# EasyEDA Pro project MPU6050模块.epro

# Schematic Schematic1
Board Name: Board1; Create Date: 2025-09-03; Page Name: P1; Project Name: MPU6050; Schematic Name: Schematic1; Update Date: 2025-09-03; Company: 嘉立创EDA; Page Size: A4; Version: V1.0
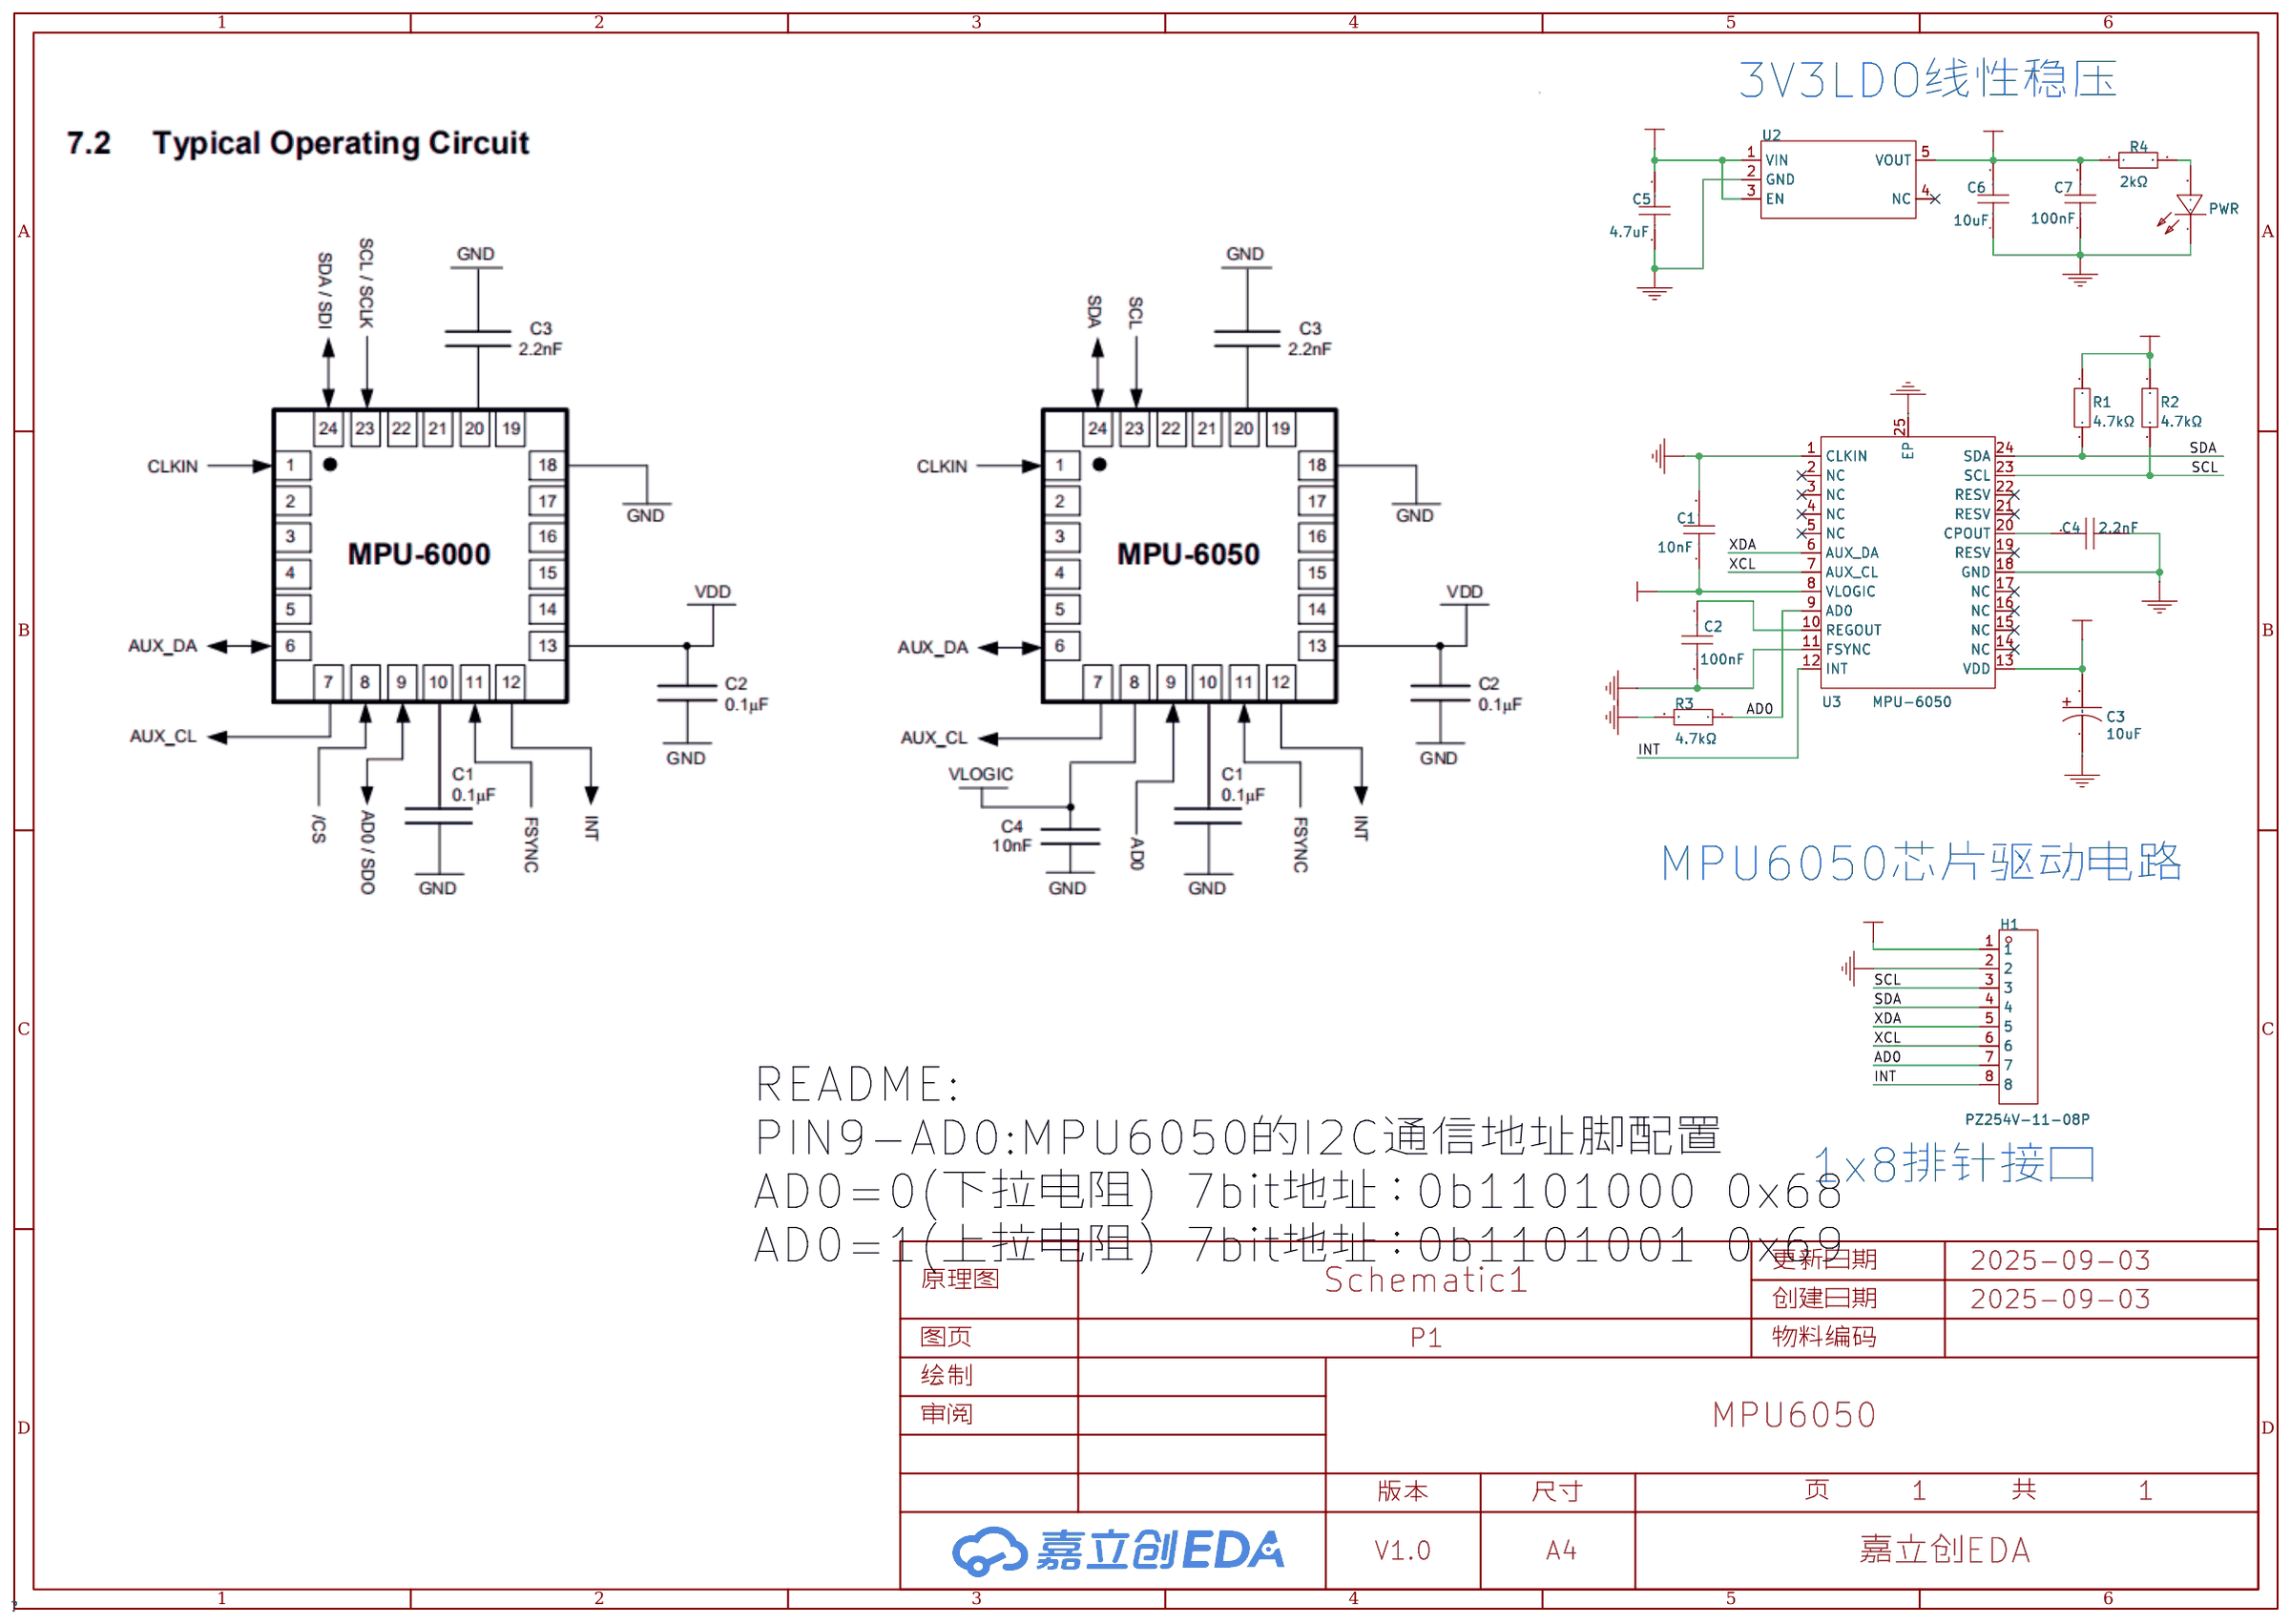
[diagram p0: schematic sheet]

## Parts
C1  10nF  [C0402]
C2  100nF  [C0402]
C3  10uF  [CAP-SMD_L3.2-W1.6]
C4  2.2nF  [C0402]
C5  4.7uF  [C0402]
C6  10uF  [C0402]
C7  100nF  [C0402]
H1  PZ254V-11-08P  [HDR-TH_8P-P2.54-V-M]
PWR  LTST-C193KRKT-5A  [LED0603-RD]
R1  4.7kΩ  [R0402]
R2  4.7kΩ  [R0402]
R3  4.7kΩ  [R0402]
R4  2kΩ  [R0402]
U2  HX9193-33GB  [SOT-23-5_L3.0-W1.7-P0.95-LS2.8-BR]
U3  MPU-6050  [QFN-24_L4.0-W4.0-P0.50-BL-EP2.7]

## Library data of the parts
C1 = CL05B103KB5NNNC: 容值:10nF;精度:±10%;额定电压:50V;温度系数:X7R;; LCSC Part Name: 10nF ±10% 50V; Supplier Part: C15195; Manufacturer: SAMSUNG(三星); Supplier Footprint: 0402; JLCPCB Part Class: Basic Part; Datasheet: https://item.szlcsc.com/datasheet/CL05B103KB5NNNC/15869.html; Supplier: LCSC; Tolerance: ±10%; Voltage Rating: 50V; Temperature Coefficient: X7R
C2 C7 = CL05B104KO5NNNC: 容值:100nF;精度:±10%;额定电压:16V;材质(温度系数):X7R;; LCSC Part Name: 100nF ±10% 16V; Supplier Part: C1525; Manufacturer: SAMSUNG(三星); Supplier Footprint: 0402; JLCPCB Part Class: Basic Part; Datasheet: https://atta.szlcsc.com/upload/public/pdf/source/20160218/1457707763339.pdf; Supplier: LCSC; Tolerance: ±10%; Voltage Rated: 16V; Temperature Coefficient: X7R
C3 = TPSA106K016R1000: 容值:10uF;精度:±10%;额定电压:16V;等效串联电阻:1Ω@100kHz;; LCSC Part Name: 10uF ±10% 16V; Supplier Part: C282116; Manufacturer: Kyocera AVX; Supplier Footprint: CASE-A-3216-18(mm); JLCPCB Part Class: Extended Part; Datasheet: https://atta.szlcsc.com/upload/public/pdf/source/20181129/C308928_3E6DA6FC57C95F0966ACBCD944046350.pdf; Supplier: LCSC; Tolerance: ±10%; Rated Voltage: 16V; Equivalent Series Resistance(ESR): 1Ω@100kHz; Operating Temperature: -55℃~+125℃
C4 = 0402B222K500NT: 容值:2.2nF;精度:±10%;额定电压:50V;材质(温度系数):X7R;; LCSC Part Name: 2.2nF ±10% 50V; Supplier Part: C1531; Manufacturer: FH(风华); Supplier Footprint: 0402; JLCPCB Part Class: Extended Part; Datasheet: https://atta.szlcsc.com/upload/public/pdf/source/20200305/C486355_26A10D38EF8C2A5C37091D0039909270.pdf; Supplier: LCSC; Tolerance: ±10%; Voltage Rated: 50V; Temperature Coefficient: X7R
C5 = CL05A475MP5NRNC: 容值:4.7uF;精度:±20%;额定电压:10V;材质(温度系数):X5R;; LCSC Part Name: 4.7uF ±20% 10V; Supplier Part: C23733; Manufacturer: SAMSUNG(三星); Supplier Footprint: 0402; JLCPCB Part Class: Basic Part; Datasheet: https://atta.szlcsc.com/upload/public/pdf/source/20160218/1457707763339.pdf; Supplier: LCSC; Tolerance: ±20%; Voltage Rated: 10V; Temperature Coefficient: X5R
C6 = CL05A106MQ5NUNC: 容值:10uF;精度:±20%;额定电压:6.3V;材质(温度系数):X5R;; LCSC Part Name: 10uF ±20% 6.3V; Supplier Part: C15525; Manufacturer: SAMSUNG(三星); Supplier Footprint: 0402; JLCPCB Part Class: Basic Part; Datasheet: https://atta.szlcsc.com/upload/public/pdf/source/20220823/2B02EE04F8F211D38A52DCB16EB6BEBA.pdf; Supplier: LCSC; Tolerance: ±20%; Voltage Rated: 6.3V; Temperature Coefficient: X5R
H1 = PZ254V-11-08P: 插针结构:1x8P;间距:2.54mm;行距:-;圆针/方针:方针;安装类型:直插;排数:单排;总PIN位数:8P;额定电流:-;额定电压:-;配合针长度:6mm;塑高:2.5mm;端接针长度:3mm;触头材质:黄铜;触头镀层:-;工作温度范围:-40℃~+105℃;颜色:黑色;; LCSC Part Name: 间距:2.54mm 1x8P 直插 方针; Supplier Part: C492407; Manufacturer: XFCN(兴飞); Supplier Footprint: 插件,P=2.54mm; JLCPCB Part Class: 扩展库; Datasheet: https://atta.szlcsc.com/upload/public/pdf/source/20200309/C492407_83A6FB26A2233368EDB9516968EC6149.pdf; Supplier: LCSC; Pin Structure: 1x8P; Pitch: 2.54mm; Circluar Pins/Square Pins: 方针; Mounting Type: 直插; Number of Rows: 单排; Number of Pins: 8P; Length of Mating Pin: 6mm; Insulation Height: 2.5mm; Length of End Connection Pin: 3mm; Contact Material: 黄铜; Operating Temperature Range: -40℃~+105℃; Color: 黑色
PWR = LTST-C193KRKT-5A: 发光颜色:红色;正向电压(VF):2V;功率:50mW;正向电流:5mA;主波长:631nm;二极管配置:-;透镜颜色:无色透明透镜;色温:-;发光强度:26.05mcd;发光角度:130°;载带方式:-;工作温度:-30℃~+85℃;; LCSC Part Name: 红灯; Supplier Part: C157741; Manufacturer: LITEON(光宝); Supplier Footprint: 0603; JLCPCB Part Class: 扩展库; Datasheet: https://atta.szlcsc.com/upload/public/pdf/source/20180224/C157741_15194362116061363471.PDF; Supplier: LCSC; Emitted Color: 红色; Forward Voltage (VF): 2V; Power Dissipation: 50mW; Forward Current: 5mA; Dominant Wavelength: 631nm; Peak Wavelength: 639nm; Lens Color: 无色透明透镜; Luminous Intensity: 26.05mcd; Viewing Angle: 130°; Operating Temperature: -30℃~+85℃
R1-R3 = 0402WGF4701TCE: 电阻类型:厚膜电阻;阻值:4.7kΩ;精度:±1%;功率:62.5mW;最大工作电压:50V;温度系数:±100ppm/℃;; LCSC Part Name: 4.7kΩ ±1% 62.5mW 厚膜电阻; Supplier Part: C25900; Manufacturer: UNI-ROYAL(厚声); Supplier Footprint: 0402; JLCPCB Part Class: Basic Part; Datasheet: https://atta.szlcsc.com/upload/public/pdf/source/20200306/C422600_1E6D84923E4A46A82E41ADD87F860B5C.pdf; Supplier: LCSC; Type: 厚膜电阻; Tolerance: ±1%; Power(Watts): 62.5mW; Overload Voltage (Max): 50V; Temperature Coefficient: ±100ppm/℃; Operating Temperature Range: -55℃~+155℃
R4 = 0402WGF2001TCE: 电阻类型:厚膜电阻;阻值:2kΩ;精度:±1%;功率:62.5mW;最大工作电压:50V;温度系数:±100ppm/℃;; LCSC Part Name: 2kΩ ±1% 62.5mW 厚膜电阻; Supplier Part: C4109; Manufacturer: UNI-ROYAL(厚声); Supplier Footprint: 0402; JLCPCB Part Class: Basic Part; Datasheet: https://atta.szlcsc.com/upload/public/pdf/source/20200306/C422600_1E6D84923E4A46A82E41ADD87F860B5C.pdf; Supplier: LCSC; Type: 厚膜电阻; Tolerance: ±1%; Power(Watts): 62.5mW; Overload Voltage (Max): 50V; Temperature Coefficient: ±100ppm/℃; Operating Temperature Range: -55℃~+155℃
U2 = HX9193-33GB: 输出类型:固定;最大输入电压:6V;输出电压:3.3V;最大输出电流:600mA;电源纹波抑制比(PSRR):65dB@(1kHz);输出极性:正极;; LCSC Part Name: 输入6V 输出3.3V 600mA; Supplier Part: C296123; Manufacturer: HX(恒佳兴); Supplier Footprint: SOT-23-5; JLCPCB Part Class: Extended Part; Datasheet: https://atta.szlcsc.com/upload/public/pdf/source/20181113/C296125_4A6BFA04F91094CE246063098530E6D9.pdf; Supplier: LCSC; Output Type: 固定; Maximum Input Voltage: 6V; Output Voltage: 3.3V; MAX Output Current: 600mA; Power Supply Rejection Ratio (PSRR): 65dB@(1kHz); Dropout Voltage: 480mV@(600mA); Output Polarity: 正极; Number of Outputs: 1
U3 = MPU-6050: 传感器类型:加速度计陀螺仪;; Supplier Part: C24112; Manufacturer: TDK InvenSense(应美盛); Supplier Footprint: QFN-24-EP(4x4); JLCPCB Part Class: 扩展库; Datasheet: https://atta.szlcsc.com/upload/public/pdf/source/20140425/1457707046159.pdf; Supplier: LCSC; Sensor Type: 加速度计陀螺仪; Operating Temperature: -40℃~+85℃

## Nets
3V3: C1.1 C3.1 C6.2 C7.2 R1.2 R2.2 R4.1 U2.5(VOUT) U3.8(VLOGIC) U3.13(VDD)
GND: C1.2 C2.2 C3.2 C4.1 C5.1 C6.1 C7.1 H1.2 PWR.1(K) R3.2 U2.2(GND) U3.1(CLKIN) U3.11(FSYNC) U3.18(GND) U3.25(EP)
AD0: H1.7 R3.1 U3.9(AD0)
INT: H1.8 U3.12(INT)
MAX6V_IN: C5.2 H1.1 U2.1(VIN) U2.3(EN)
SCL: H1.3 R2.1 U3.23(SCL)
SDA: H1.4 R1.1 U3.24(SDA)
XCL: H1.6 U3.7(AUX_CL)
XDA: H1.5 U3.6(AUX_DA)
$1N905: C4.2 U3.20(CPOUT)
$1N912: C2.1 U3.10(REGOUT)
$1N928: PWR.2(A) R4.2

Not connected (* = marked no-connect by the designer): U2 4(NC)*; U3 2(NC)* 3(NC)* 4(NC)* 5(NC)* 14(NC)* 15(NC)* 16(NC)* 17(NC)* 19(RESV)* 21(RESV)* 22(RESV)*

## Notes on the sheet
- 3V3LDO线性稳压
- MPU6050芯片驱动电路
- README:
  PIN9-AD0:MPU6050的I2C通信地址脚配置
  AD0=0(下拉电阻) 7bit地址：0b1101000 0x68
  AD0=1(上拉电阻) 7bit地址：0b1101001 0x69
- 1x8排针接口

# Board PCB1
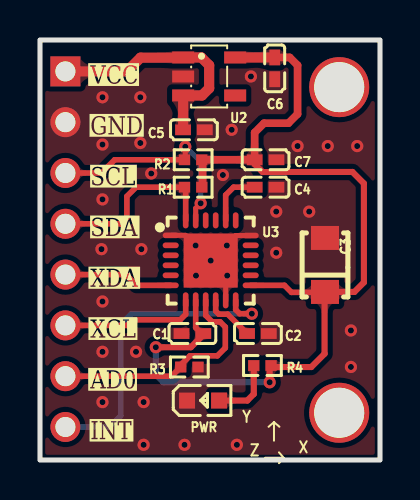
[diagram p1: board, top side]
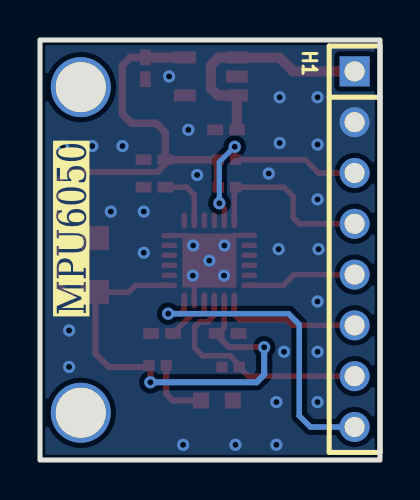
[diagram p2: board, bottom side, seen from below]

Outline 17 x 21 mm; copper layers: Top Layer, Bottom Layer. Coordinates in mm from the lower left corner of the outline.
Outline path: rectangle 0,21 17,0
Stack: Top Layer 0.035mm / Dielectric1 1.51mm FR4 er 4.5 / Bottom Layer 0.035mm

## Design rules (mm)
template: 自定义配置
spacing copperThickness1oz (default): track to track 0.102, other pairs 0.152 to 0.3
spacing copperThickness2oz: track to track 0.203, other pairs 0.152 to 0.3
track width copperThickness1oz (default): min 0.127, default 0.254, max 2.54
track width copperThickness2oz: min 0.203, default 0.254, max 2.54
differential pair differentialPair (default): width min 0.127, default 0.254, max 2.54; gap min 0.152, default 0.152
via viaSize (default): diameter min 0.5, default 0.61, max 10; hole min 0.3, default 0.305, max 6.3

## Placement (name value [footprint] x y rotation side)
C1  10nF  [C0402]  7.62 6.32 180 top
C2  100nF  [C0402]  10.9 6.32 0 top
C3  10uF  [CAP-SMD_L3.2-W1.6]  14.25 9.75 90 top
C4  2.2nF  [C0402]  11.28 13.64 180 top
C5  4.7uF  [C0402]  7.7 16.51 180 top
C6  10uF  [C0402]  11.74 19.58 90 top
C7  100nF  [C0402]  11.28 15.01 180 top
H1  PZ254V-11-08P  [HDR-TH_8P-P2.54-V-M]  1.27 10.54 270 bottom
NOREF  -  [Pad_e261]  14.96 2.36 0 top
NOREF#2  -  [Pad_e262]  14.96 18.64 0 top
PWR  LTST-C193KRKT-5A  [LED0603-RD]  8.15 2.97 0 top
R1  4.7kΩ  [R0402]  7.66 13.64 0 top
R2  4.7kΩ  [R0402]  7.66 15.01 0 top
R3  4.7kΩ  [R0402]  7.47 4.65 0 top
R4  2kΩ  [R0402]  11.12 4.72 180 top
U2  HX9193-33GB  [SOT-23-5_L3.0-W1.7-P0.95-LS2.8-BR]  8.46 19.18 180 top
U3  MPU-6050  [QFN-24_L4.0-W4.0-P0.50-BL-EP2.7]  8.53 9.98 270 top

## Footprints (pads in the part's own frame, mm; a bottom-side part is the same pattern mirrored in y, then rotated)
C0402
  rect 0.79x0.54 smd: 1(-0.545,0) 2(0.545,0)
CAP-SMD_L3.2-W1.6
  rect 1.2x1.4 smd: 1(-1.35,0) 2(1.35,0)
HDR-TH_8P-P2.54-V-M
  rect 1.5x1.5 hole 1: 1(-8.89,0)
  round 1.5 hole 1: 2(-6.35,0) 3(-3.81,0) 4(-1.27,0) 5(1.27,0) 6(3.81,0) 7(6.35,0) 8(8.89,0)
LED0603-RD
  rect 0.8x0.8 smd: 1(-0.799,0) 2(0.799,0)
Pad_e261
  round 3 hole 2.5: 1(0,0)
Pad_e262
  round 3 hole 2.5: 1(0,0)
QFN-24_L4.0-W4.0-P0.50-BL-EP2.7
  oval 0.28x0.8 smd: 1(-1.25,-2) 2(-0.75,-2) 3(-0.25,-2) 4(0.25,-2) 5(0.75,-2) 6(1.25,-2) 13(1.25,2) 14(0.75,2) 15(0.25,2) 16(-0.25,2) 17(-0.75,2) 18(-1.242,2)
  oval 0.8x0.28 smd: 7(2,-1.25) 8(2,-0.75) 9(2,-0.25) 10(2,0.25) 11(2,0.75) 12(2,1.25) 19(-2,1.25) 20(-2,0.75) 21(-2,0.25) 22(-2,-0.25) 23(-2,-0.75) 24(-2,-1.25)
  rect 2.7x2.7 smd: 25(0.013,0)
R0402
  rect 0.566x0.54 smd: 1(-0.433,0) 2(0.433,0)
SOT-23-5_L3.0-W1.7-P0.95-LS2.8-BR
  rect 1.1x0.6 smd: 1(1.3,-0.95) 2(1.3,0) 3(1.3,0.95) 4(-1.3,0.95) 5(-1.3,-0.95)

## Nets
As in the schematic.

Pads without a net: NOREF 1; NOREF#2 1; U2 4; U3 2 3 4 5 14 15 16 17 19 21 22

## Via types
v1: diameter 0.61, hole 0.305, Top Layer to Bottom Layer, 37 vias

## Routing (per net, layer and track width the routed paths; a pad name or vN(x,y) marks a point on that pad's centre or on a via; arc(x,y) is an arc through that point)
3V3: length 49.2
  Top Layer w0.28: U3.13 12.22,8.73 12.57,8.38 14.23,8.38 ; C1.1 8.08,6.32 7.78,6.62 U3.8
  Top Layer w0.305: 10.73,14.99 10.73,14.79 11.13,14.4 12.36,14.4 12.36,14.4 15.62,14.4 16.19,13.83 16.19,8.88 15.72,8.4 C3.1 14.23,8.38 14.23,5.31 13.56,4.65 11.48,4.65 v1(11.48,3.89) ; v1(5.79,5.64) 7.54,5.64 8.16,6.26 C1.1
  Top Layer w0.381: C6.2 12.49,20.13 12.88,19.74 12.88,17.3 12.42,16.84 11.2,16.84 10.73,16.37 C7.2 8.13,15.01 8.13,13.64
  Top Layer w0.508: U2.5 11.73,20.13
  Bottom Layer w0.305: v1(11.48,3.89) 6.17,3.89 5.79,4.27 v1(5.79,5.64)
GND: length 8.5
  Top Layer w0.254: v1(8.53,9.97) 8.53,9.95 v1(7.8,9.22) ; v1(8.53,9.97) v1(7.78,10.72) 7.27,11.23 U3.1 ; v1(8.53,9.97) 8.61,9.97 v1(9.36,9.22) 9.28,9.14 U3.11 ; v1(8.53,9.97) 9.79,11.22 U3.18
  vias: v1(3.12,18.14) v1(3.12,15.77) v1(3.12,13.03) v1(3.07,10.54) v1(3.12,7.92) v1(3.12,5.41) v1(3.12,2.9) v1(4.8,5.41) v1(5.02,18.14) v1(5.02,15.85) v1(5.07,10.54) v1(5.18,2.9) v1(5.18,0.76) v1(5.56,14.33) v1(7.23,0.76) v1(9.14,14.25) v1(9.34,10.72) v1(9.58,16.51) v1(9.84,0.76) v1(10.55,19.18) v1(11.81,12.42) v1(11.81,10.36) v1(12.88,15.7) v1(13.46,12.42) v1(14.39,15.7) v1(15.54,6.48) v1(15.54,4.65) v1(15.86,15.7)
AD0: length 11.7
  Top Layer w0.28: H1.7 6.58,4.19 7.03,4.65 7.01,4.67 7.01,4.72 7.5,5.21 8.87,5.21 9.27,5.61 9.27,6.65 9,6.91 8.61,6.91 8.28,7.23 U3.9
INT: length 15.7
  Top Layer w0.28: v1(10.59,7.31) 9.98,7.31 9.78,7.51 U3.12
  Bottom Layer w0.28: v1(10.59,7.31) 4.57,7.31 4.04,6.78 4.04,2.21 3.48,1.65 H1.8
MAX6V_IN: length 12
  Top Layer w0.508: C5.2 7.16,16.52 U2.3 8.1,18.23 8.46,18.59 8.46,19.74 8.07,20.13 U2.1 7.15,20.12 5.03,20.12 4.34,19.43 H1.1
SCL: length 11
  Top Layer w0.254: 7.26,15.01 v1(7.26,15.66) ; v1(8.03,12.84) 7.78,12.59 U3.23
  Top Layer w0.28: 7.26,15.01 3.73,15.01 3.07,14.35 H1.3
  Bottom Layer w0.254: v1(7.26,15.66) 7.27,15.66 8.03,14.9 v1(8.03,12.84)
SDA: length 9
  Top Layer w0.28: U3.24 7.28,13.62 7.26,13.64 4.8,13.64 4.34,13.18 4.34,12.12 4.04,11.81 H1.4
XCL: length 6.9
  Top Layer w0.28: H1.6 4.37,6.73 4.65,7.01 7.01,7.01 7.28,7.28 U3.7
XDA: length 5.5
  Top Layer w0.28: U3.6 4.83,8.73 4.29,9.27 H1.5
$1N905: length 2.9
  Top Layer w0.28: U3.20 9.28,13.25 9.68,13.64 C4.2
$1N912: length 2.6
  Top Layer w0.28: C2.1 9.39,7.29 8.94,7.29 8.78,7.45 U3.10
$1N928: length 3.3
  Top Layer w0.305: R4.2 10.69,3.3 10.36,2.97 PWR.2

## Copper pours and planes (outline as drawn; the poured copper is in the pictures)
GND on Top Layer: -2.44,23.39 19.89,23.39 19.89,-4.42 -2.44,-4.42
GND on Bottom Layer: -1.6,22.1 18.97,22.1 18.97,-1.98 -1.6,-1.98

Small or netless copper shapes (teardrops, artwork), in the pictures only: 51 on Top Layer, 6 on Bottom Layer

## Text on the board
Bottom Silkscreen Layer: MPU6050
Top Silkscreen Layer: Y | Z | X | VCC | GND | SCL | SDA | XDA | XCL | AD0 | INT | →
